# Altium schematic sheet Scheme.schdoc
size 415 x 394 mm
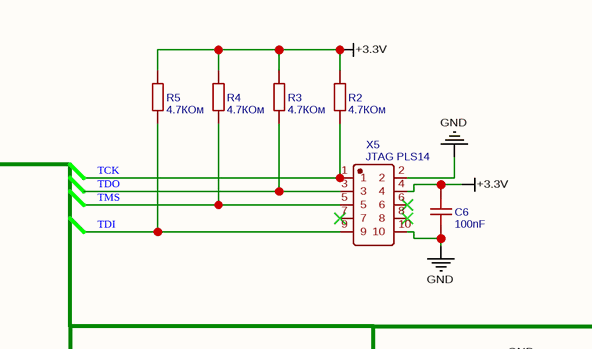
[diagram p0: Scheme.schdoc, top right]
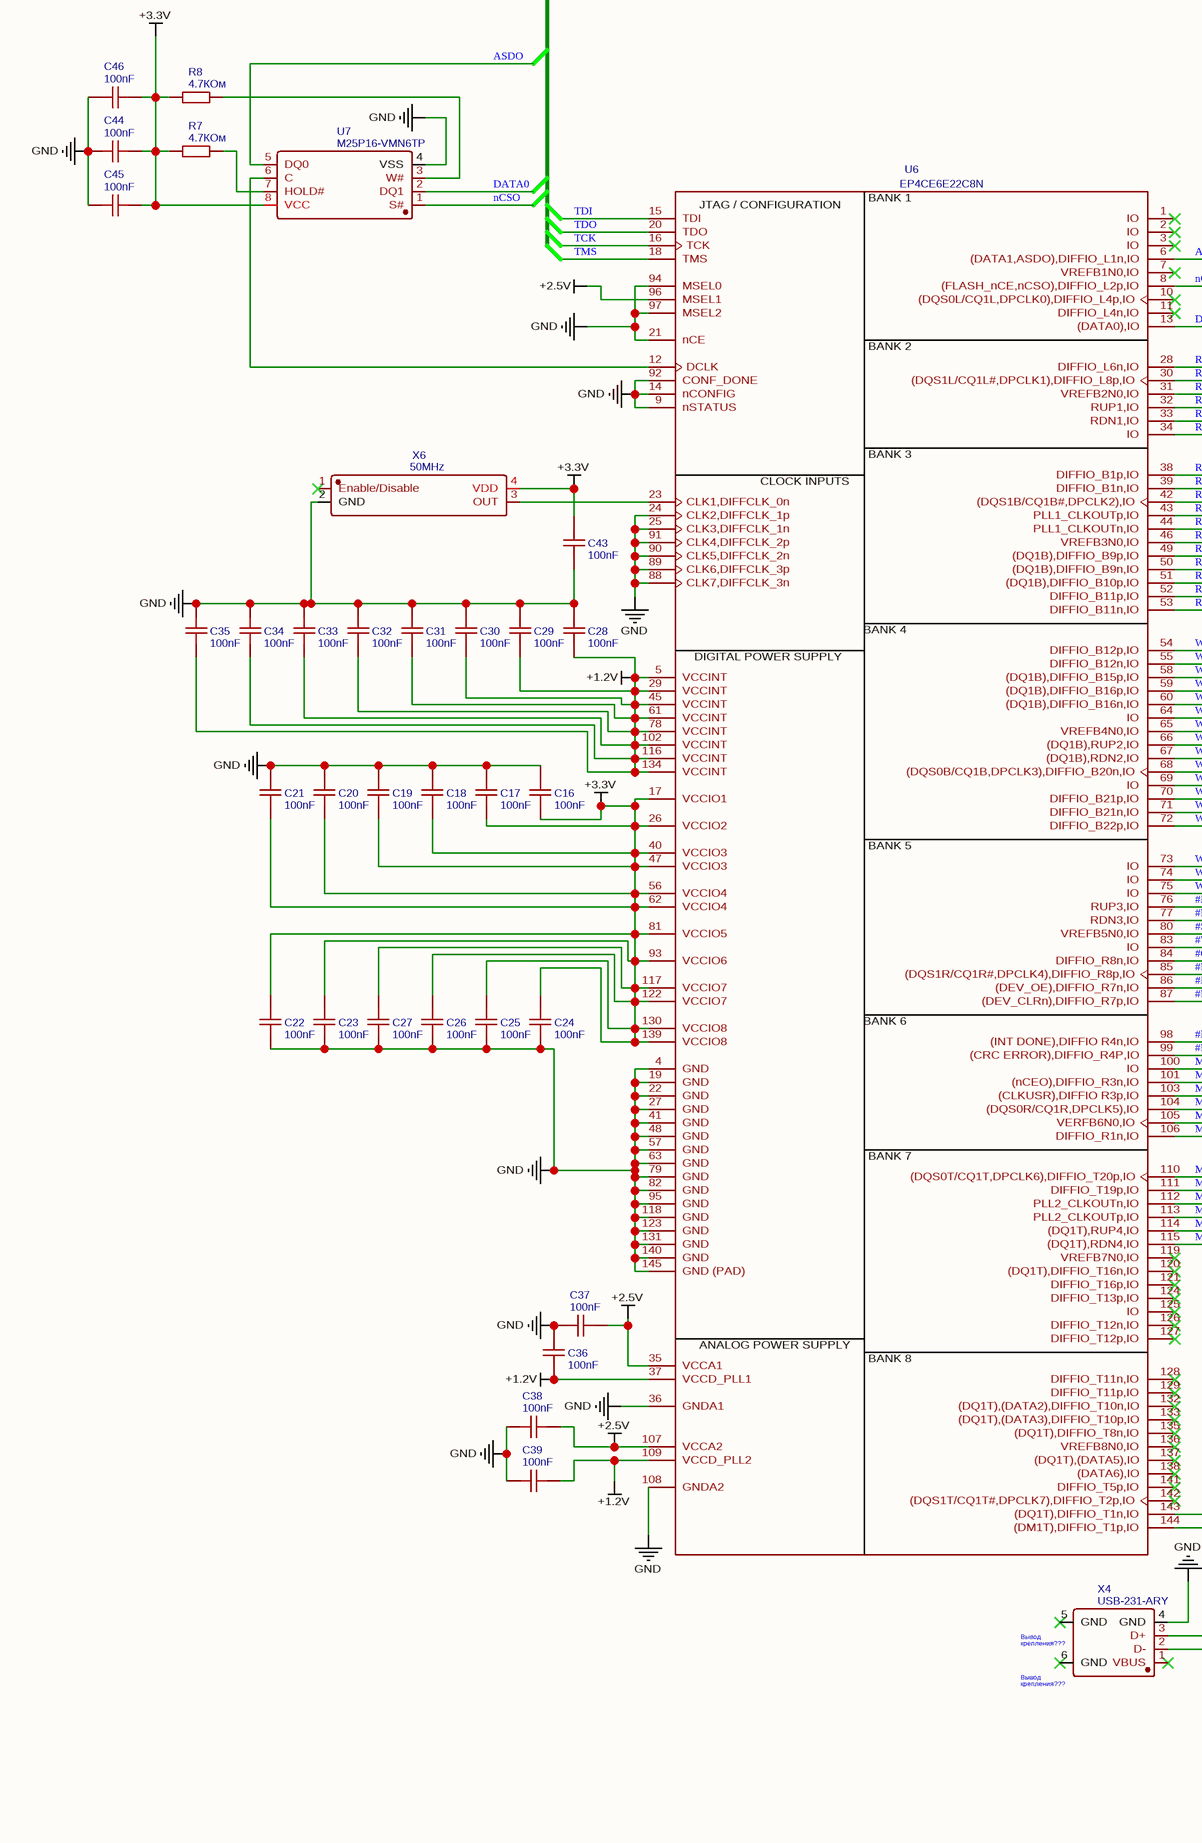
[diagram p1: Scheme.schdoc, bottom left]
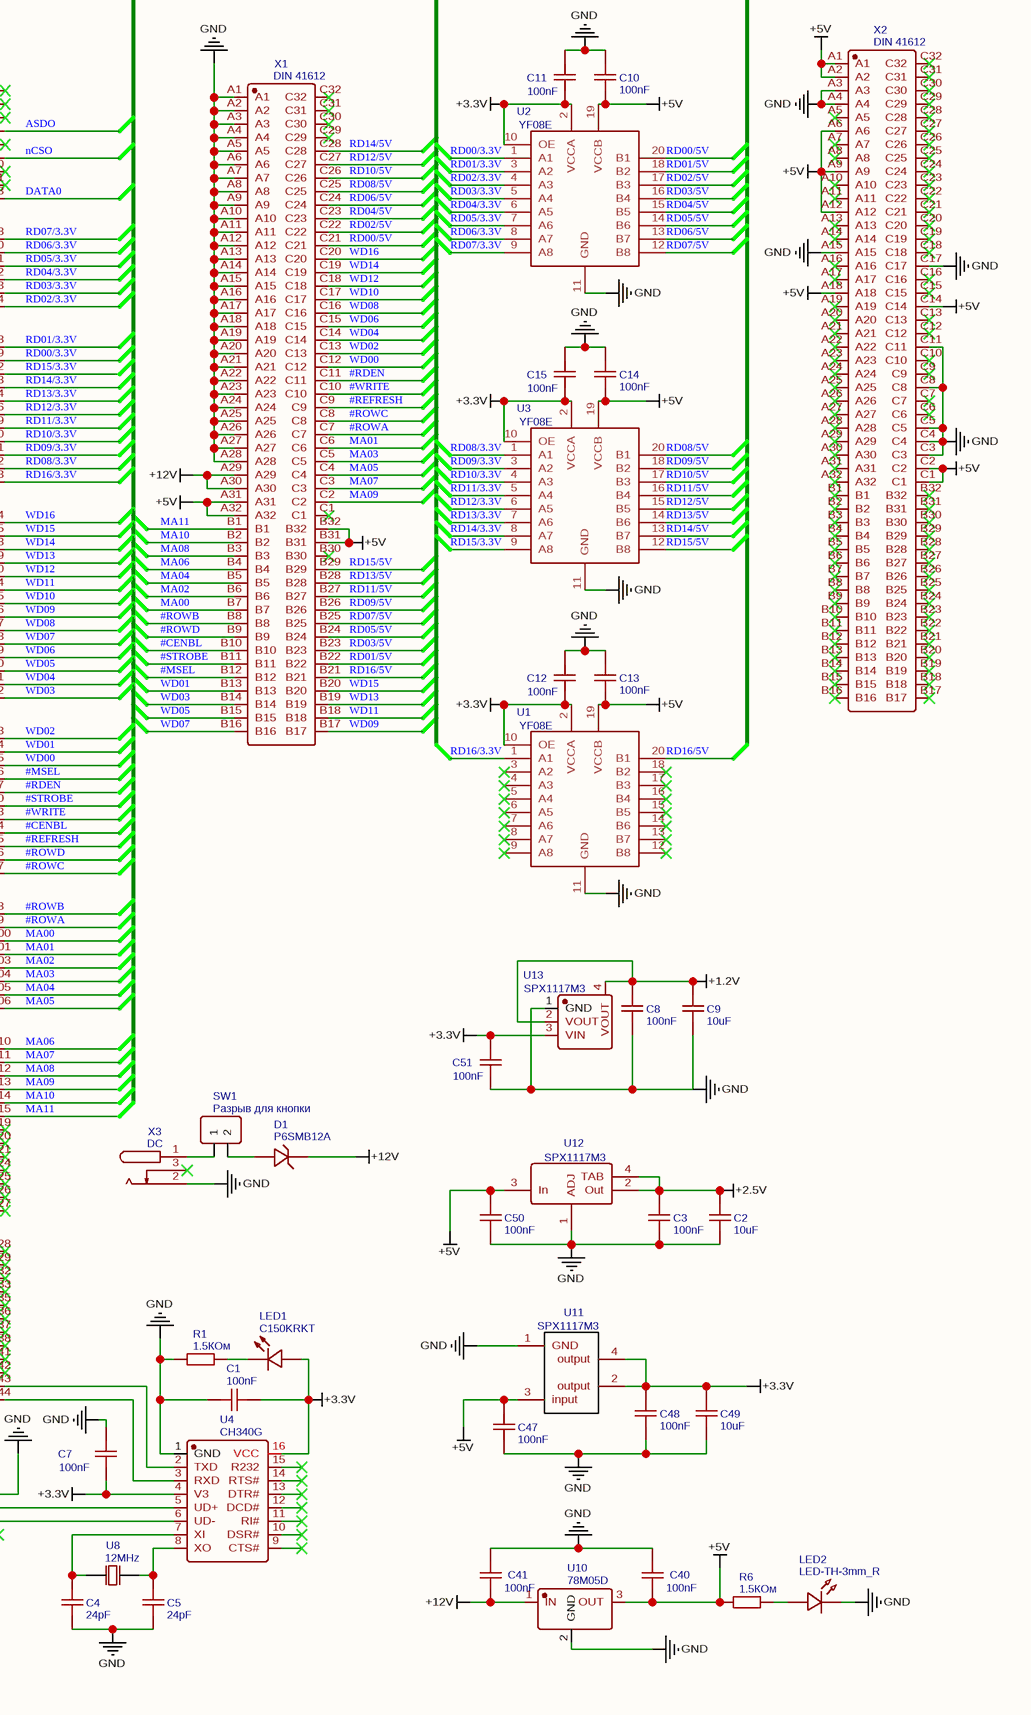
[diagram p2: Scheme.schdoc, bottom right]

## Parts
C1  100nF  [C0603]
C2  10uF  [C0603]
C3  100nF  [C0603]
C4  24pF  [C0603]
C5  24pF  [C0603]
C6  100nF  [C0603]
C7  100nF  [C0603]
C8  100nF  [C0603]
C9  10uF  [C0603]
C10  100nF  [C0603]
C11  100nF  [C0603]
C12  100nF  [C0603]
C13  100nF  [C0603]
C14  100nF  [C0603]
C15  100nF  [C0603]
C16  100nF  [C0603]
C17  100nF  [C0603]
C18  100nF  [C0603]
C19  100nF  [C0603]
C20  100nF  [C0603]
C21  100nF  [C0603]
C22  100nF  [C0603]
C23  100nF  [C0603]
C24  100nF  [C0603]
C25  100nF  [C0603]
C26  100nF  [C0603]
C27  100nF  [C0603]
C28  100nF  [C0603]
C29  100nF  [C0603]
C30  100nF  [C0603]
C31  100nF  [C0603]
C32  100nF  [C0603]
C33  100nF  [C0603]
C34  100nF  [C0603]
C35  100nF  [C0603]
C36  100nF  [C0603]
C37  100nF  [C0603]
C38  100nF  [C0603]
C39  100nF  [C0603]
C40  100nF  [C0603]
C41  100nF  [C0603]
C43  100nF  [C0603]
C44  100nF  [C0603]
C45  100nF  [C0603]
C46  100nF  [C0603]
C47  100nF  [C0603]
C48  100nF  [C0603]
C49  10uF  [C0603]
C50  100nF  [C0603]
C51  100nF  [C0603]
D1  P6SMB12A  [SMB_L4.6-W3.6-LS5.3-RD]
LED1  C150KRKT  [LED1206-RD]
LED2  LED-TH-3mm_R  [LED-TH_BD3.0_RED]
R1  1.5КОм  [R0402]
R2  4.7КОм  [R0402]
R3  4.7КОм  [R0402]
R4  4.7КОм  [R0402]
R5  4.7КОм  [R0402]
R6  1.5КОм  [R0402]
R7  4.7КОм  [R0402]
R8  4.7КОм  [R0402]
SW1  Разрыв для кнопки  [HDR-F-2.54_1X2]
U1  YF08E  [TSSOP-20_L6.5-W4.4-P0.65-LS6.4-BL]
U2  YF08E  [TSSOP-20_L6.5-W4.4-P0.65-LS6.4-BL]
U3  YF08E  [TSSOP-20_L6.5-W4.4-P0.65-LS6.4-BL]
U4  CH340G  [SOIC-16_L9.9-W3.9-P1.27-LS6.0-BL]
U6  EP4CE6E22C8N  [PQFP-144_L20.0-W20.0-P0.50-LS22.0-BL-EP]
U7  M25P16-VMN6TP  [SOIC-8_L4.9-W3.9-P1.27-LS6.0-BL]
U8  12MHz  [HC-49S_L11.5-W4.7-P4.88]
U10  78M05D  [TO-252-2_L6.6-W6.1-P4.57-LS9.9-BR-CW]
U11  SPX1117M3  [SOT-223-4_L6.5-W3.5-P2.30-LS7.0-BR]
U12  SPX1117M3  [SOT-223_L6.5-W3.5-P2.30-LS7.0-BR]
U13  SPX1117M3  [SOT-223-3_L6.5-W3.4-P2.30-LS7.0-BR]
X1  DIN 41612  [CONN-TH_WINGTAT_9001-14961C00A]
X2  DIN 41612  [CONN-TH_WINGTAT_9001-14961C00A]
X3  DC  [DC-IN_DC050-T]
X4  USB-231-ARY  [USB-A-TH_USB-231-ARY]
X5  JTAG PLS14  [HDR-TH_10P-P2.54-V-M-R2-C5-S2.54]
X6  50MHz  [OSC-SMD_4P-L7.0-W5.0-BL]

## Nets
+1.2V: C8.2 C9.2 C28.1 C29.1 C30.1 C31.1 C32.1 C33.1 C34.1 C35.1 C36.2 C39.1 U6.5(VCCINT) U6.29(VCCINT) U6.37(VCCD_PLL1) U6.45(VCCINT) U6.61(VCCINT) U6.78(VCCINT) U6.102(VCCINT) U6.109(VCCD_PLL2) U6.116(VCCINT) U6.134(VCCINT) U13.2(VOUT) U13.4(VOUT)
+2.5V: C2.2 C3.2 C37.1 C38.2 U6.35(VCCA1) U6.96(MSEL1) U6.107(VCCA2) U12.2(Out) U12.4(TAB)
+3.3V: C1.2 C6.2 C7.1 C11.1 C12.1 C15.1 C16.1 C17.1 C18.1 C19.1 C20.1 C21.1 C22.2 C23.2 C24.2 C25.2 C26.2 C27.2 C43.2 C44.1 C45.1 C46.1 C48.2 C49.2 C51.2 LED1.2(A) R2.1 R3.1 R4.1 R5.1 R7.1 R8.1 U1.2(VCCA) U1.10(OE) U2.2(VCCA) U2.10(OE) U3.2(VCCA) U3.10(OE) U4.4(V3) U4.16(VCC) U6.17(VCCIO1) U6.26(VCCIO2) U6.40(VCCIO3) U6.47(VCCIO3) U6.56(VCCIO4) U6.62(VCCIO4) U6.81(VCCIO5) U6.93(VCCIO6) U6.117(VCCIO7) U6.122(VCCIO7) U6.130(VCCIO8) U6.139(VCCIO8) U7.8(VCC) U11.2(output) U11.4(output) U13.3(VIN) X5.4 X6.4(VDD)
+5V: C10.1 C13.1 C14.1 C40.2 C47.2 C50.2 R6.1 U1.19(VCCB) U2.19(VCCB) U3.19(VCCB) U10.3(OUT) U11.3(input) U12.3(In) X1.A31 X1.A32 X1.B31 X1.B32 X2.A1 X2.A2 X2.A6 X2.A9 X2.A12 X2.A18 X2.C1 X2.C2 X2.C14
+12V: C41.2 D1.1 U10.1(IN) X1.A29 X1.A30
GND: C1.1 C2.1 C3.1 C4.1 C5.1 C6.1 C7.2 C8.1 C9.1 C10.2 C11.2 C12.2 C13.2 C14.2 C15.2 C16.2 C17.2 C18.2 C19.2 C20.2 C21.2 C22.1 C23.1 C24.1 C25.1 C26.1 C27.1 C28.2 C29.2 C30.2 C31.2 C32.2 C33.2 C34.2 C35.2 C36.1 C37.2 C38.1 C39.2 C40.1 C41.1 C43.1 C44.2 C45.2 C46.2 C47.1 C48.1 C49.1 C50.1 C51.1 LED2.2 R1.1 U1.11(GND) U2.11(GND) U3.11(GND) U4.1(GND) U6.4(GND) U6.9(nSTATUS) U6.14(nCONFIG) U6.19(GND) U6.21(nCE) U6.22(GND) U6.24(CLK2,DIFFCLK_1p) U6.25(CLK3,DIFFCLK_1n) U6.27(GND) U6.36(GNDA1) U6.41(GND) U6.48(GND) U6.57(GND) U6.63(GND) U6.79(GND) U6.82(GND) U6.88(CLK7,DIFFCLK_3n) U6.89(CLK6,DIFFCLK_3p) U6.90(CLK5,DIFFCLK_2n) U6.91(CLK4,DIFFCLK_2p) U6.92(CONF_DONE) U6.94(MSEL0) U6.95(GND) U6.97(MSEL2) U6.108(GNDA2) U6.118(GND) U6.123(GND) U6.131(GND) U6.140(GND) U6.145(GND_(PAD)) U7.4(VSS) U10.2(GND) U11.1(GND) U12.1(ADJ) U13.1(GND) X1.A1 X1.A2 X1.A3 X1.A4 X1.A5 X1.A6 X1.A7 X1.A8 X1.A9 X1.A10 X1.A11 X1.A12 X1.A13 X1.A14 X1.A15 X1.A16 X1.A17 X1.A18 X1.A19 X1.A20 X1.A21 X1.A22 X1.A23 X1.A24 X1.A25 X1.A26 X1.A27 X1.A28 X2.A3 X2.A4 X2.A15 X2.C3 X2.C4 X2.C5 X2.C8 X2.C11 X2.C17 X3.2 X4.4(GND) X5.2 X5.10 X6.2(GND)
#CENBL: U6.84(DIFFIO_R8n,IO) X1.B10
#MSEL: U6.76(RUP3,IO) X1.B12
#RDEN: U6.77(RDN3,IO) X1.C11
#REFRESH: U6.85((DQS1R/CQ1R#,DPCLK4),DIFFIO_R8p,IO) X1.C9
#ROWA: U6.99((CRC_ERROR),DIFFIO_R4P,IO) X1.C7
#ROWB: U6.98((INT_DONE),DIFFIO_R4n,IO) X1.B8
#ROWC: U6.87((DEV_CLRn),DIFFIO_R7p,IO) X1.C8
#ROWD: U6.86((DEV_OE),DIFFIO_R7n,IO) X1.B9
#STROBE: U6.80(VREFB5N0,IO) X1.B11
#WRITE: U6.83(IO) X1.C10
ASDO: U6.6((DATA1,ASDO),DIFFIO_L1n,IO) U7.5(DQ0)
DATA0: U6.13((DATA0),IO) U7.2(DQ1)
MA00: U6.100(IO) X1.B7
MA01: U6.101((nCEO),DIFFIO_R3n,IO) X1.C6
MA02: U6.103((CLKUSR),DIFFIO_R3p,IO) X1.B6
MA03: U6.104((DQS0R/CQ1R,DPCLK5),IO) X1.C5
MA04: U6.105(VERFB6N0,IO) X1.B5
MA05: U6.106(DIFFIO_R1n,IO) X1.C4
MA06: U6.110((DQS0T/CQ1T,DPCLK6),DIFFIO_T20p,IO) X1.B4
MA07: U6.111(DIFFIO_T19p,IO) X1.C3
MA08: U6.112(PLL2_CLKOUTn,IO) X1.B3
MA09: U6.113(PLL2_CLKOUTp,IO) X1.C2
MA10: U6.114((DQ1T),RUP4,IO) X1.B2
MA11: U6.115((DQ1T),RDN4,IO) X1.B1
nCSO: U6.8((FLASH_nCE,nCSO),DIFFIO_L2p,IO) U7.1(S#)
RD00/3.3V: U2.1(A1) U6.39(DIFFIO_B1n,IO)
RD00/5V: U2.20(B1) X1.C21
RD01/3.3V: U2.3(A2) U6.38(DIFFIO_B1p,IO)
RD01/5V: U2.18(B2) X1.B22
RD02/3.3V: U2.4(A3) U6.34(IO)
RD02/5V: U2.17(B3) X1.C22
RD03/3.3V: U2.5(A4) U6.33(RDN1,IO)
RD03/5V: U2.16(B4) X1.B23
RD04/3.3V: U2.6(A5) U6.32(RUP1,IO)
RD04/5V: U2.15(B5) X1.C23
RD05/3.3V: U2.7(A6) U6.31(VREFB2N0,IO)
RD05/5V: U2.14(B6) X1.B24
RD06/3.3V: U2.8(A7) U6.30((DQS1L/CQ1L#,DPCLK1),DIFFIO_L8p,IO)
RD06/5V: U2.13(B7) X1.C24
RD07/3.3V: U2.9(A8) U6.28(DIFFIO_L6n,IO)
RD07/5V: U2.12(B8) X1.B25
RD08/3.3V: U3.1(A1) U6.52(DIFFIO_B11p,IO)
RD08/5V: U3.20(B1) X1.C25
RD09/3.3V: U3.3(A2) U6.51((DQ1B),DIFFIO_B10p,IO)
RD09/5V: U3.18(B2) X1.B26
RD10/3.3V: U3.4(A3) U6.50((DQ1B),DIFFIO_B9n,IO)
RD10/5V: U3.17(B3) X1.C26
RD11/3.3V: U3.5(A4) U6.49((DQ1B),DIFFIO_B9p,IO)
RD11/5V: U3.16(B4) X1.B27
RD12/3.3V: U3.6(A5) U6.46(VREFB3N0,IO)
RD12/5V: U3.15(B5) X1.C27
RD13/3.3V: U3.7(A6) U6.44(PLL1_CLKOUTn,IO)
RD13/5V: U3.14(B6) X1.B28
RD14/3.3V: U3.8(A7) U6.43(PLL1_CLKOUTp,IO)
RD14/5V: U3.13(B7) X1.C28
RD15/3.3V: U3.9(A8) U6.42((DQS1B/CQ1B#,DPCLK2),IO)
RD15/5V: U3.12(B8) X1.B29
RD16/3.3V: U1.1(A1) U6.53(DIFFIO_B11n,IO)
RD16/5V: U1.20(B1) X1.B21
TCK: R2.2 U6.16(TCK) X5.1
TDI: R5.2 U6.15(TDI) X5.9
TDO: R3.2 U6.20(TDO) X5.3
TMS: R4.2 U6.18(TMS) X5.5
WD00: U6.75(IO) X1.C12
WD01: U6.74(IO) X1.B13
WD02: U6.73(IO) X1.C13
WD03: U6.72(DIFFIO_B22p,IO) X1.B14
WD04: U6.71(DIFFIO_B21n,IO) X1.C14
WD05: U6.70(DIFFIO_B21p,IO) X1.B15
WD06: U6.69(IO) X1.C15
WD07: U6.68((DQS0B/CQ1B,DPCLK3),DIFFIO_B20n,IO) X1.B16
WD08: U6.67((DQ1B),RDN2,IO) X1.C16
WD09: U6.66((DQ1B),RUP2,IO) X1.B17
WD10: U6.65(VREFB4N0,IO) X1.C17
WD11: U6.64(IO) X1.B18
WD12: U6.60((DQ1B),DIFFIO_B16n,IO) X1.C18
WD13: U6.59((DQ1B),DIFFIO_B16p,IO) X1.B19
WD14: U6.58((DQ1B),DIFFIO_B15p,IO) X1.C19
WD15: U6.55(DIFFIO_B12n,IO) X1.B20
WD16: U6.54(DIFFIO_B12p,IO) X1.C20
NetC4_2: C4.2 U4.7(XI) U8.1(OSC1)
NetC5_2: C5.2 U4.8(XO) U8.2(OSC2)
NetD1_2: D1.2 SW1.2
NetLED1_1: LED1.1(K) R1.2
NetLED2_1: LED2.1 R6.2
NetR7_2: R7.2 U7.7(HOLD#)
NetR8_2: R8.2 U7.3(W#)
NetSW1_1: SW1.1 X3.1
NetU4_2: U4.2(TXD) U6.143((DQ1T),DIFFIO_T1n,IO)
NetU4_3: U4.3(RXD) U6.144((DM1T),DIFFIO_T1p,IO)
NetU4_5: U4.5(UD+) X4.3(D+)
NetU4_6: U4.6(UD-) X4.2(D-)
NetU6_12: U6.12(DCLK) U7.6(C)
NetU6_23: U6.23(CLK1,DIFFCLK_0n) X6.3(OUT)

Not connected (* = marked no-connect by the designer): U1 3(A2)* 4(A3)* 5(A4)* 6(A5)* 7(A6)* 8(A7)* 9(A8)* 12(B8)* 13(B7)* 14(B6)* 15(B5)* 16(B4)* 17(B3)* 18(B2)*; U4 9(CTS#)* 10(DSR#)* 11(RI#)* 12(DCD#)* 13(DTR#)* 14(RTS#)* 15(R232)*; U6 1(IO)* 2(IO)* 3(IO)* 7(VREFB1N0,IO)* 10((DQS0L/CQ1L,DPCLK0),DIFFIO_L4p,IO)* 11(DIFFIO_L4n,IO)* 119(VREFB7N0,IO)* 120((DQ1T),DIFFIO_T16n,IO)* 121(DIFFIO_T16p,IO)* 124(DIFFIO_T13p,IO)* 125(IO)* 126(DIFFIO_T12n,IO)* 127(DIFFIO_T12p,IO)* 128(DIFFIO_T11n,IO)* 129(DIFFIO_T11p,IO)* 132((DQ1T),(DATA2),DIFFIO_T10n,IO)* 133((DQ1T),(DATA3),DIFFIO_T10p,IO)* 135((DQ1T),DIFFIO_T8n,IO)* 136(VREFB8N0,IO)* 137((DQ1T),(DATA5),IO)* 138((DATA6),IO)* 141(DIFFIO_T5p,IO)* 142((DQS1T/CQ1T#,DPCLK7),DIFFIO_T2p,IO)*; X1 B30* C1* C29* C30* C31* C32*; X2 A5* A7* A8* A10* A11* A13* A14* A16* A17* A19* A20* A21* A22* A23* A24* A25* A26* A27* A28* A29* A30* A31* A32* B1* B2* B3* B4* B5* B6* B7* B8* B9* B10* B11* B12* B13* B14* B15* B16* B17* B18* B19* B20* B21* B22* B23* B24* B25* B26* B27* B28* B29* B30* B31* B32* C6* C7* C9* C10* C12* C13* C15* C16* C18* C19* C20* C21* C22* C23* C24* C25* C26* C27* C28* C29* C30* C31* C32*; X3 3*; X4 1(VBUS)* 5(GND)* 6(GND)*; X5 6* 7* 8*; X6 1(Enable/Disable)*

## Notes on the sheet
- (near X4) Вывод
  крепления???
- (in symbol EP4CE6E22C8N) BANK 1; JTAG / CONFIGURATION; BANK 2; BANK 3; CLOCK INPUTS; BANK 4; DIGITAL POWER SUPPLY; BANK 5; BANK 6; BANK 7; ANALOG POWER SUPPLY; BANK 8

## Library data of the parts
C1 C3 C6-C8 C10-C41 C43-C48 C50 C51 = 100nF: Manufacturer: muRata(村田); Manufacturer Part: GRM188R72A104KA35D; nameAlias: Value; Supplier: LCSC; Supplier Part: C77058; JLCPCB Part Class: Extended Part; spicePre: C; spiceSymbolName: GRM188R72A104KA35D
C2 C9 C49 = 10uF: Manufacturer: muRata(村田); Manufacturer Part: GRM188R72A104KA35D; nameAlias: Value; Supplier: LCSC; Supplier Part: C77058; JLCPCB Part Class: Extended Part; spicePre: C; spiceSymbolName: GRM188R72A104KA35D
C4 C5 = 24pF: Manufacturer: muRata(村田); Manufacturer Part: GRM1885C2A240JA01D; nameAlias: Value; Contributor: LCSC; Supplier: LCSC; Supplier Part: C469169; JLCPCB Part Class: Extended Part; spicePre: C; spiceSymbolName: GRM1885C2A240JA01D
D1 = P6SMB12A: Manufacturer: Littelfuse(美国力特); Contributor: LCSC; Supplier: LCSC; Supplier Part: C223973; Manufacturer Part: P6SMB12A; JLCPCB Part Class: Extended Part; spicePre: D; spiceSymbolName: P6SMB12A
LED1 = C150KRKT: Manufacturer: LITEON(光宝); Manufacturer Part: LTST-C150KRKT; Contributor: LCSC; Supplier: LCSC; Supplier Part: C125086; JLCPCB Part Class: Extended Part; spicePre: L; spiceSymbolName: LTST-C150KRKT
LED2 = LED-TH-3mm_R: Manufacturer: EVERLIGHT(台湾亿光); Manufacturer Part: 204-10SDRD/S530-A3-L; Contributor: LCEDA_Lib; Supplier Part: C84774; Supplier: LCSC; spicePre: L; spiceSymbolName: LED-TH-3mm_R
R1 R6 = 1.5КОм: Manufacturer: UNI-ROYAL(厚声); Manufacturer Part: 0402WGJ068JTCE; nameAlias: Value; Contributor: LCSC; Supplier: LCSC; Supplier Part: C270402; JLCPCB Part Class: Extended Part; spicePre: R; spiceSymbolName: 0402WGJ068JTCE
R2-R5 R7 R8 = 4.7КОм: Manufacturer: UNI-ROYAL(厚声); Manufacturer Part: 0402WGJ068JTCE; nameAlias: Value; Contributor: LCSC; Supplier: LCSC; Supplier Part: C270402; JLCPCB Part Class: Extended Part; spicePre: R; spiceSymbolName: 0402WGJ068JTCE
SW1 = Разрыв для кнопки: Contributor: LCEDA_Lib; Supplier Part: C49661; Supplier: LCSC; spicePre: H; spiceSymbolName: HDR-F-2.54_1x2
U1-U3 = YF08E: Manufacturer: TI(德州仪器); Manufacturer Part: TXS0108EPWR; Supplier: LCSC; Supplier Part: C17206; JLCPCB Part Class: Extended Part; spicePre: U; spiceSymbolName: TXS0108EPWR
U4 = CH340G: Manufacturer: WCH(南京沁恒); timeStamp: 1468327462; Supplier: LCSC; Manufacturer Part: CH340G; Supplier Part: C14267; JLCPCB Part Class: Extended Part; spicePre: U; spiceSymbolName: CH340G
U6 = EP4CE6E22C8N: Contributor: petercost3; spicePre: U; spiceSymbolName: EP4CE6E22C8N
U7 = M25P16-VMN6TP: Manufacturer: micron(镁光); Contributor: LCSC; Supplier: LCSC; Manufacturer Part: M25P16-VMN6TP; Supplier Part: C151067; JLCPCB Part Class: Extended Part; spicePre: U; spiceSymbolName: M25P16-VMN6TP
U8 = 12MHz: Manufacturer: YXC(扬兴晶振); Manufacturer Part: H1OSC-SUG-12M; nameAlias: Value; Contributor: lcsc; Supplier: LCSC; Supplier Part: C20617528; JLCPCB Part Class: Extended Part; spicePre: X; spiceSymbolName: H1OSC-SUG-12M
U10 = 78M05D: Manufacturer: 晶导微电子; Contributor: lcsc; Supplier: LCSC; Supplier Part: C7528188; Manufacturer Part: 78M05D; JLCPCB Part Class: Extended Part; spicePre: U; spiceSymbolName: 78M05D
U11 = SPX1117M3: Manufacturer: MaxLinear(迈凌); Manufacturer Part: SPX1117M3-L-3-3/TR; Supplier: LCSC; Supplier Part: C6862; JLCPCB Part Class: Extended Part; spicePre: U; spiceSymbolName: SPX1117M3-L-3-3/TR
U12 = SPX1117M3: Manufacturer: MaxLinear(迈凌); Manufacturer Part: SPX1117M3-L-2-5/TR; Contributor: LCSC; Supplier: LCSC; Supplier Part: C916002; JLCPCB Part Class: Extended Part; spicePre: U; spiceSymbolName: SPX1117M3-L-2-5/TR
U13 = SPX1117M3: Manufacturer: MaxLinear(迈凌); Manufacturer Part: SPX1117M3-L-1-5/TR; Contributor: LCSC; Supplier: LCSC; Supplier Part: C517962; JLCPCB Part Class: Extended Part; spicePre: U; spiceSymbolName: SPX1117M3-L-1-5/TR
X1 X2 = DIN 41612: Manufacturer: WingTAT(格林柏); Manufacturer Part: 9001-14961C00A; Contributor: lcsc; Supplier: LCSC; Supplier Part: C5173367; JLCPCB Part Class: Extended Part; spicePre: U; spiceSymbolName: 9001-14961C00A
X3 = DC: Manufacturer: SHOU HAN(首韩); Manufacturer Part: DC050-T; Contributor: LCSC; Supplier: LCSC; Supplier Part: C431534; JLCPCB Part Class: Extended Part; spicePre: D; spiceSymbolName: DC050-T
X4 = USB-231-ARY: Manufacturer: XUNPU(讯普); Contributor: LCSC; Supplier: LCSC; Supplier Part: C720525; Manufacturer Part: USB-231-ARY; JLCPCB Part Class: Extended Part; spicePre: U; spiceSymbolName: USB-231-ARY
X5 = JTAG PLS14: Manufacturer: Megastar(兆星); Manufacturer Part: ZX-PZ2.54-2-5PZZ; Contributor: lcsc; Supplier: LCSC; Supplier Part: C7501276; JLCPCB Part Class: Extended Part; spicePre: U; spiceSymbolName: ZX-PZ2.54-2-5PZZ
X6 = 50MHz: Manufacturer: YXC(扬兴晶振); Manufacturer Part: OT705050MJBA4SL; nameAlias: Value; Contributor: LCSC; Supplier: LCSC; Supplier Part: C669094; JLCPCB Part Class: Extended Part; spicePre: X; spiceSymbolName: OT705050MJBA4SL